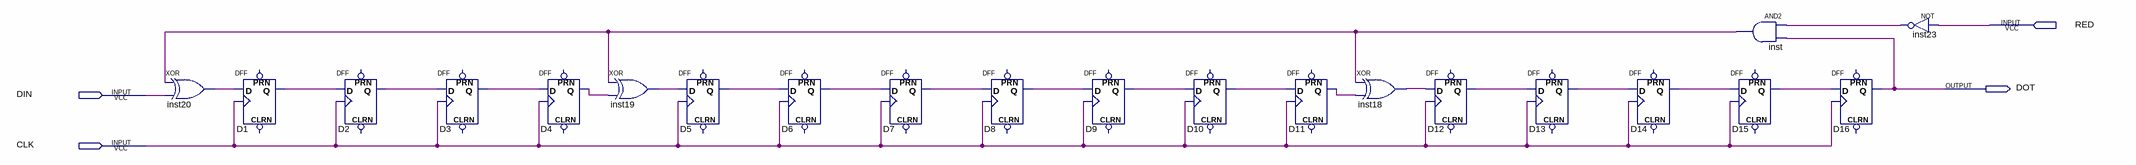
[diagram p0: schematic sheet]
// Quartus schematic CRC-Full.bdf as structural Verilog: 21 symbols, 4 pins
module \CRC-Full  (
  input  RED,
  input  DIN,
  input  CLK,
  output DOT
);

  wire D1_q, D2_q, D3_q, D4_q, D5_q, D6_q, D7_q, D8_q, D9_q, D10_q, D11_q, D12_q, D13_q, D14_q, D15_q,
       inst18_out, inst19_out, inst20_out, inst23_out, inst_out;

  xor inst20 (inst20_out, inst_out, DIN);
  DFF D1 (.CLK(CLK), .D(inst20_out), .Q(D1_q));  // open: CLRN, PRN
  DFF D2 (.CLK(CLK), .D(D1_q), .Q(D2_q));  // open: CLRN, PRN
  DFF D3 (.CLK(CLK), .D(D2_q), .Q(D3_q));  // open: CLRN, PRN
  DFF D4 (.CLK(CLK), .D(D3_q), .Q(D4_q));  // open: CLRN, PRN
  xor inst19 (inst19_out, inst_out, D4_q);
  DFF D5 (.CLK(CLK), .D(inst19_out), .Q(D5_q));  // open: CLRN, PRN
  DFF D6 (.CLK(CLK), .D(D5_q), .Q(D6_q));  // open: CLRN, PRN
  DFF D7 (.CLK(CLK), .D(D6_q), .Q(D7_q));  // open: CLRN, PRN
  DFF D8 (.CLK(CLK), .D(D7_q), .Q(D8_q));  // open: CLRN, PRN
  DFF D9 (.CLK(CLK), .D(D8_q), .Q(D9_q));  // open: CLRN, PRN
  DFF D10 (.CLK(CLK), .D(D9_q), .Q(D10_q));  // open: CLRN, PRN
  DFF D11 (.CLK(CLK), .D(D10_q), .Q(D11_q));  // open: CLRN, PRN
  xor inst18 (inst18_out, inst_out, D11_q);
  DFF D12 (.CLK(CLK), .D(inst18_out), .Q(D12_q));  // open: CLRN, PRN
  DFF D13 (.CLK(CLK), .D(D12_q), .Q(D13_q));  // open: CLRN, PRN
  DFF D14 (.CLK(CLK), .D(D13_q), .Q(D14_q));  // open: CLRN, PRN
  and inst (inst_out, inst23_out, DOT);
  DFF D15 (.CLK(CLK), .D(D14_q), .Q(D15_q));  // open: CLRN, PRN
  DFF D16 (.CLK(CLK), .D(D15_q), .Q(DOT));  // open: CLRN, PRN
  not inst23 (inst23_out, RED);
endmodule
